# EAGLE design untitled (EAGLE 9.5.1)
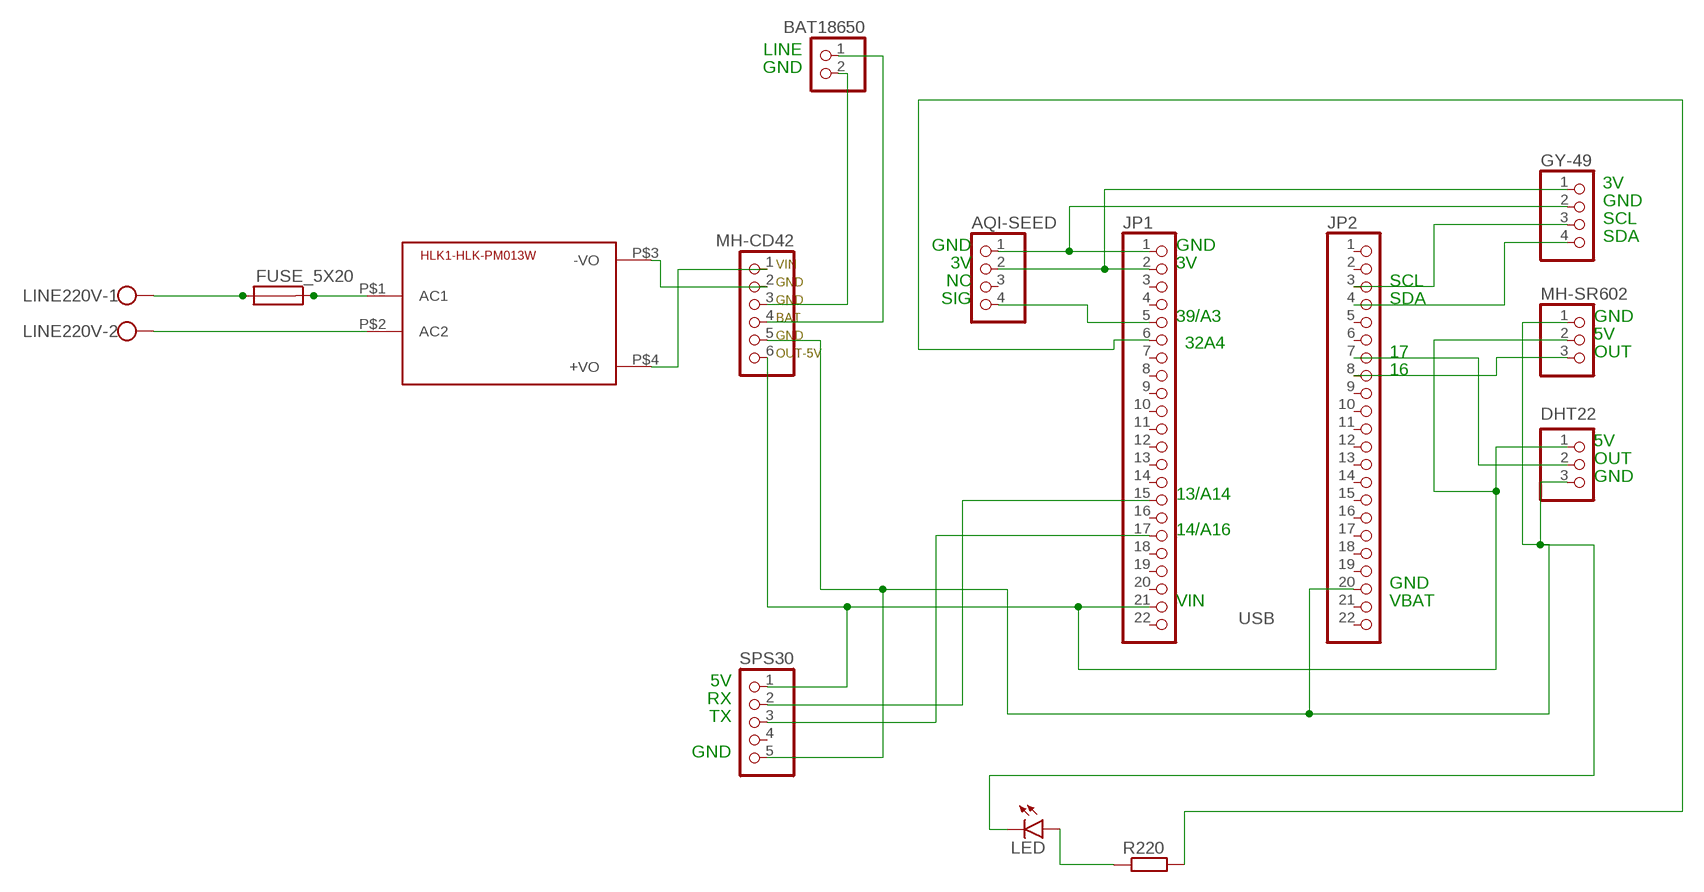
[diagram p0: schematic, sheet 1]

## Parts
AQI-SEED  PINHD-1X4  [1X04]
BAT18650  PINHD-1X2  [1X02]
FUSE_5X20  FH_5X20  [FH_5X20]
GY-49  PINHD-1X4  [1X04]
HLK1-HLK-PM013W  HLK-PM013W  [HLK-PM01]
JP1  PINHD-1X22  [1X22]
JP2  PINHD-1X22  [1X22]
JP6  DHT22  PINHD-1X3  [1X03]
LED  LED3MM  [LED3MM]
LINE220V  W237-102  [W237-102]
MH-CD42  PINHD-1X6  [1X06]
MH-SR602  PINHD-1X3  [1X03]
R220  R-EU_0204/5  [0204/5]
SPS30  PINHD-1X5  [1X05]

## Nets
N$1: FUSE_5X20.1A FUSE_5X20.1B LINE220V.1
N$2: FUSE_5X20.2A FUSE_5X20.2B HLK1-HLK-PM013W.P$1(AC1)
N$3: HLK1-HLK-PM013W.P$2(AC2) LINE220V.2
N$4: HLK1-HLK-PM013W.P$4(+VO) MH-CD42.1
N$5: HLK1-HLK-PM013W.P$3(-VO) MH-CD42.2
N$6: JP1.21 JP6.1 MH-CD42.6 MH-SR602.2 SPS30.1
N$7: JP2.20 JP6.3 LED.K(C) MH-CD42.5 MH-SR602.1 SPS30.5
N$8: JP2.7 JP6.2
N$9: JP2.8 MH-SR602.3
N$10: GY-49.4 JP2.4
N$11: GY-49.3 JP2.3
N$12: AQI-SEED.2 GY-49.1 JP1.2
N$13: AQI-SEED.1 GY-49.2 JP1.1
N$14: AQI-SEED.4 JP1.5
N$15: JP1.15 SPS30.2
N$16: LED.A R220.1
N$17: JP1.17 SPS30.3
N$18: BAT18650.2 MH-CD42.3
N$19: BAT18650.1 MH-CD42.4
N$20: JP1.6 R220.2
Unconnected: AQI-SEED.3 JP1.3 JP1.4 JP1.7 JP1.8 JP1.9 JP1.10 JP1.11 JP1.12 JP1.13 JP1.14 JP1.16 JP1.18 JP1.19 JP1.20 JP1.22 JP2.1 JP2.2 JP2.5 JP2.6 JP2.9 JP2.10 JP2.11 JP2.12 JP2.13 JP2.14 JP2.15 JP2.16 JP2.17 JP2.18 JP2.19 JP2.21 JP2.22 SPS30.4

## Notes on the sheet
- LINE
- GND
- 3V
- GND
- SCL
- SDA
- GND | GND
- VIN | 3V | 3V
- GND | NC | SCL
- GND | SIG | SDA
- BAT | 39/A3 | GND
- GND | 5V
- 32A4
- OUT-5V | 17 | OUT
- 16
- 5V
- OUT
- GND
- 13/A14
- 14/A16
- GND
- VIN | VBAT
- USB
- 5V
- RX
- TX
- GND

## Library data of the parts
AQI-SEED GY-49 = pinhead:PINHD-1X4: PIN HEADER
BAT18650 = pinhead:PINHD-1X2: PIN HEADER
FUSE_5X20 = keystone:FH_5X20: FUSE 5 x 20 mm
HLK1-HLK-PM013W = HLK-PM01:HLK-PM01: Hi-Link Power Supply HLK-PM01 3W Author: Ahmed Said <https://github.com/AhmedSaid/EAGLELibraries>
JP1 JP2 = pinhead:PINHD-1X22: PIN HEADER
JP6 MH-SR602 = pinhead:PINHD-1X3: PIN HEADER
LED = led:LED: LED OSRAM: - CHIPLED LG R971, LG N971, LY N971, LG Q971, LY Q971, LO R971, LY R971 LH N974, LH R974 LS Q976, LO Q976, LY Q976 LO Q996 - Hyper CHIPLED LW Q18S LB Q993, LB Q99A, LB R99A - SideLED LS A670, LO A670, LY A670, LG A670, LP A670 LB A673, LV A673, LT A673, LW A673 LH A674 LY A675 LS A676, LA A676, LO A676, LY A676, LW A676 LS A679, LY A679, LG A679 - Hyper Micro SIDELED® LS Y876, LA Y876, LO Y876, LY Y876 LT Y87S - SmartLED LW L88C, LW L88S LB L89C, LB L89S, LG L890 LS L89K, LO L89K, LY L89K LS L896, LA L896, LO L896, LY L896 - TOPLED LS T670, LO T670, LY T670, LG T670, LP T670 LSG T670, LSP T670, LSY T670, LOP T670, LYG T670 LG T671, LOG T671, LSG T671 LB T673, LV T673, LT T673, LW T673 LH T674 LS T676, LA T676, LO T676, LY T676, LB T676, LH T676, LSB T676, LW T676 LB T67C, LV T67C, LT T67C, LS T67K, LO T67K, LY T67K, LW E67C LS E67B, LA E67B, LO E67B, LY E67B, LB E67C, LV E67C, LT E67C LW T67C LS T679, LY T679, LG T679 LS T770, LO T770, LY T770, LG T770, LP T770 LB T773, LV T773, LT T773, LW T773 LH T774 LS E675, LA E675, LY E675, LS T675 LS T776, LA T776, LO T776, LY T776, LB T776 LHGB T686 LT T68C, LB T68C - Hyper Mini TOPLED® LB M676 - Mini TOPLED Santana® LG M470 LS M47K, LO M47K, LY M47K Source: http://www.osram.convergy.de LUXEON: - LUMILED® LXK2-PW12-R00, LXK2-PW12-S00, LXK2-PW14-U00, LXK2-PW14-V00 LXK2-PM12-R00, LXK2-PM12-S00, LXK2-PM14-U00 LXK2-PE12-Q00, LXK2-PE12-R00, LXK2-PE12-S00, LXK2-PE14-T00, LXK2-PE14-U00 LXK2-PB12-K00, LXK2-PB12-L00, LXK2-PB12-M00, LXK2-PB14-N00, LXK2-PB14-P00, LXK2-PB14-Q00 LXK2-PR12-L00, LXK2-PR12-M00, LXK2-PR14-Q00, LXK2-PR14-R00 LXK2-PD12-Q00, LXK2-PD12-R00, LXK2-PD12-S00 LXK2-PH12-R00, LXK2-PH12-S00 LXK2-PL12-P00, LXK2-PL12-Q00, LXK2-PL12-R00 Source: www.luxeon.com KINGBRIGHT: KA-3528ASYC Source: www.kingbright.com
LINE220V = con-wago-500:W237-102: WAGO SCREW CLAMP; MPN: 237-102; OC_FARNELL: unknown; OC_NEWARK: 70K9898
MH-CD42 = pinhead:PINHD-1X6: PIN HEADER; SPICEPREFIX: X
R220 = rcl:R-EU_: RESISTOR, European symbol; SPICEPREFIX: R
SPS30 = pinhead:PINHD-1X5: PIN HEADER

## Board
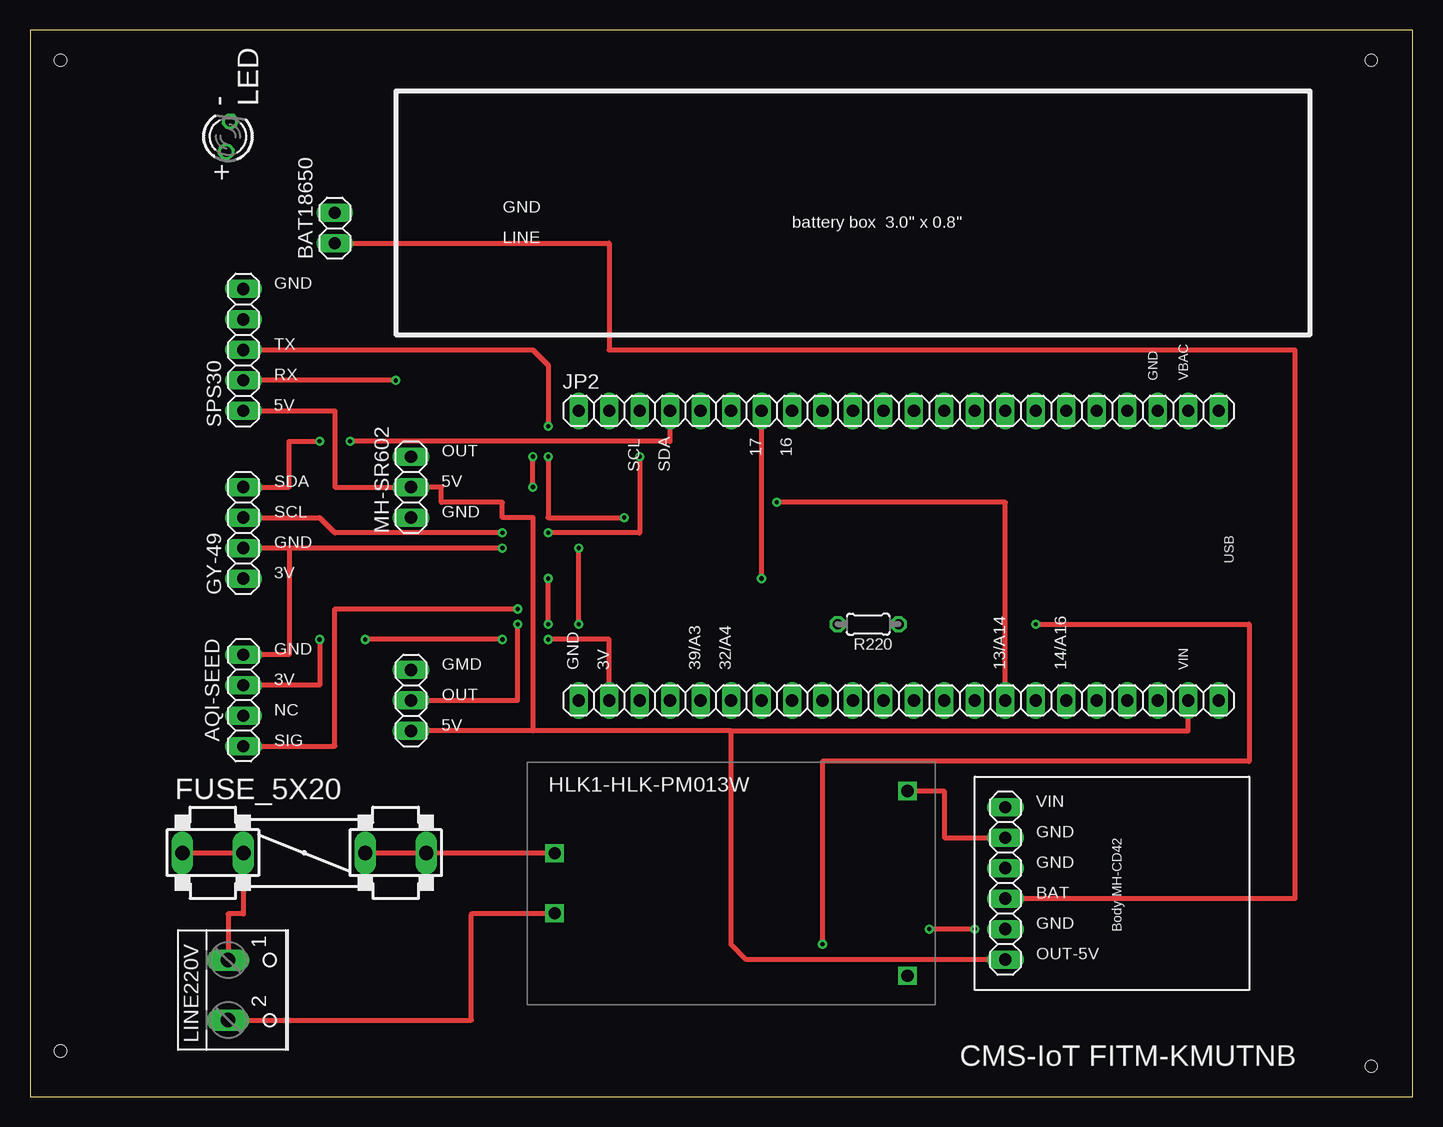
[diagram p1: board, top side]
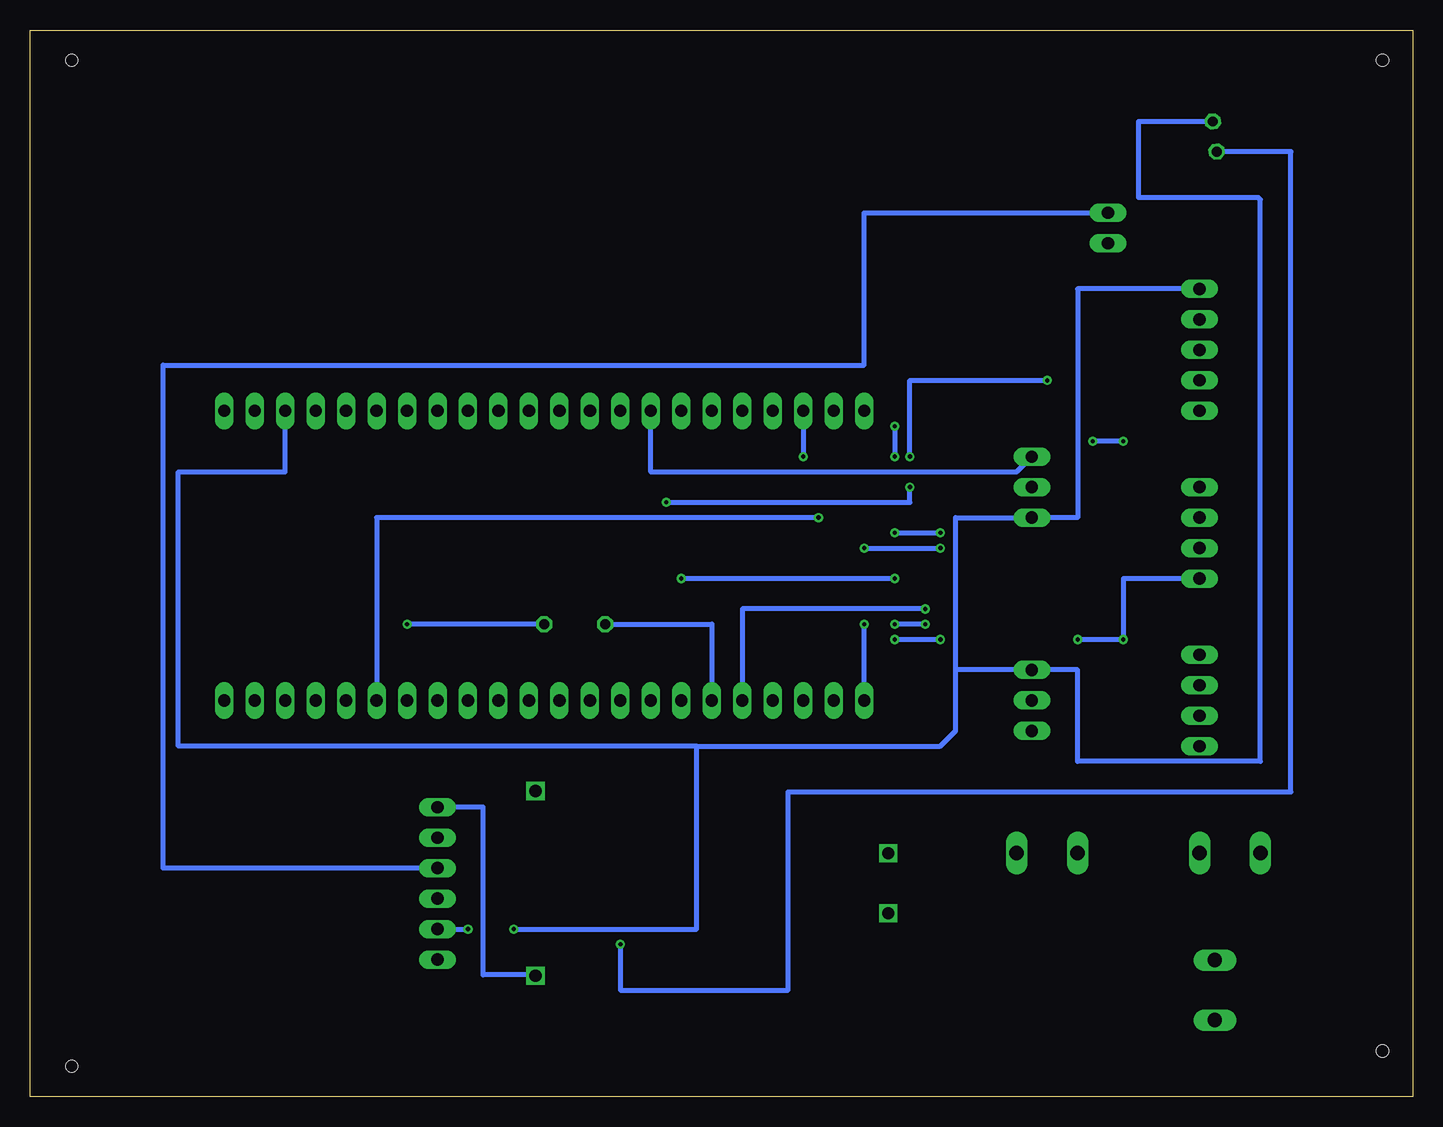
[diagram p2: board, bottom side, seen from below]

Size 115.24 x 88.89 mm. Coordinates in mm from the lower left corner, seen from the top.
Outline: 0,0 115.24,0 115.24,88.89 0,88.89 0,0
Copper layers (1*16): Top 0.035mm / dielectric 1.5mm / Bottom 0.035mm
Design rules "default": minimum track width 6mil, minimum drill 0.35mm, track to track 6mil, track to pad 6mil, pad to pad 6mil, via to via 6mil, smd to smd 6mil, copper to edge 40mil, drill to drill 6mil, minimum pad ring 10mil, minimum via ring 8mil, stop-mask expansion 4mil, vias tented up to drill 0mil, thermal gap 10mil
Holes 1 mm at 111.76,2.54 111.76,86.36 2.54,86.36 2.54,3.81

### Footprints (pad centres in the part's own frame; a part is rotated, then mirrored left to right if it is on the bottom)
1X04 = drill 1.016 long: 1 -3.81,0; 2 -1.27,0; 3 1.27,0; 4 3.81,0
1X02 = drill 1.016 long: 1 -1.27,0; 2 1.27,0
FH_5X20 = drill 1.194 long: 1A -10.16,0; 1B -5.08,0; 2A 10.16,0; 2B 5.08,0
HLK-PM01 = drill 1.016 square: P$1 -14.7,2.5; P$2 -14.7,-2.5; P$3 14.7,7.7; P$4 14.7,-7.7
1X22 = drill 1.016 long: 1 -26.67,0; 2 -24.13,0; 3 -21.59,0; 4 -19.05,0; 5 -16.51,0; 6 -13.97,0; 7 -11.43,0; 8 -8.89,0; 9 -6.35,0; 10 -3.81,0; 11 -1.27,0; 12 1.27,0; 13 3.81,0; 14 6.35,0; 15 8.89,0; 16 11.43,0; 17 13.97,0; 18 16.51,0; 19 19.05,0; 20 21.59,0; 21 24.13,0; 22 26.67,0
1X03 = drill 1.016 long: 1 -2.54,0; 2 0,0; 3 2.54,0
LED3MM = drill 0.813 octagon: A -1.27,0; K 1.27,0
W237-102 = drill 1.194 long: 1 -2.5,-1.27; 2 2.5,-1.27
1X06 = drill 1.016 long: 1 -6.35,0; 2 -3.81,0; 3 -1.27,0; 4 1.27,0; 5 3.81,0; 6 6.35,0
0204/5 = drill 0.813 octagon: 1 -2.54,0; 2 2.54,0
1X05 = drill 1.016 long: 1 -5.08,0; 2 -2.54,0; 3 0,0; 4 2.54,0; 5 5.08,0

### Placement (x,y rotation side)
AQI-SEED  17.78,33.02 270 top
BAT18650  25.4,72.39 90 top
FUSE_5X20  22.86,20.32 0 top
GY-49  17.78,46.99 90 top
HLK1-HLK-PM013W  58.42,17.78 0 top
JP1  72.39,33.02 0 top
JP2  72.39,57.15 0 top
JP6  31.75,33.02 90 top
LED  16.51,80.01 82.9 top
LINE220V  17.78,8.89 270 top
MH-CD42  81.28,17.78 270 top
MH-SR602  31.75,50.8 90 top
R220  69.85,39.37 180 top
SPS30  17.78,62.23 90 top

### Tracks (layer width: path | path; a pad name or v marks a point on that pad's centre or on a via)
N$1
  Top 0.406: LINE220V.1 16.51,15.24 17.78,15.24 FUSE_5X20.1B FUSE_5X20.1A
N$2
  Top 0.406: HLK1-HLK-PM013W.P$1 43.68,20.32 FUSE_5X20.2A FUSE_5X20.2B
N$3
  Top 0.406: LINE220V.2 36.79,6.39 36.79,15.2 36.83,15.24 36.87,15.28 HLK1-HLK-PM013W.P$2
N$4
  Bottom 0.406: HLK1-HLK-PM013W.P$4 73.2,10.16 77.47,10.16 77.47,24.13 MH-CD42.1
N$5
  Top 0.406: HLK1-HLK-PM013W.P$3 76.12,25.48 76.2,25.4 76.2,21.59 MH-CD42.2
N$6
  Top 0.406: MH-CD42.6 59.69,11.43 58.42,12.7 58.42,30.48 | 58.42,30.48 41.91,30.48 | 41.91,30.48 JP6.1 | 58.42,30.48 96.52,30.48 JP1.21 | 41.91,30.48 41.91,48.26 39.37,48.26 39.37,49.53 34.29,49.53 34.29,50.8 MH-SR602.2 25.4,50.8 25.4,57.15 SPS30.1
N$7  (via drill 0.35)
  Top 0.406: v78.74,13.97 v74.93,13.97
  Bottom 0.406: MH-CD42.5 v78.74,13.97 | v74.93,13.97 59.69,13.97 59.69,29.21 | 59.69,29.21 102.87,29.21 102.87,52.07 93.98,52.07 JP2.20 | 59.69,29.21 39.37,29.21 38.1,30.48 38.1,35.56 | 38.1,35.56 JP6.3 27.94,35.56 27.94,27.94 12.7,27.94 12.7,74.76 12.87,74.93 22.86,74.93 22.86,81.28 LED.K | 38.1,35.56 38.1,48.26 MH-SR602.1 27.94,48.26 27.94,67.31 SPS30.5
N$8  (via drill 0.35)
  Top 0.406: JP6.2 40.64,33.02 v40.64,39.37 | v43.18,39.37 v43.18,43.18 | v60.96,43.18 JP2.7
  Bottom 0.406: v40.64,39.37 v43.18,39.37 | v43.18,43.18 v60.96,43.18
N$9
  Bottom 0.406: MH-SR602.3 33.02,52.07 63.5,52.07 JP2.8
N$10  (via drill 0.35)
  Top 0.406: GY-49.4 21.59,50.8 21.59,54.61 v24.13,54.61 | JP2.4 53.34,54.61 v26.67,54.61
  Bottom 0.406: v24.13,54.61 v26.67,54.61
N$11  (via drill 0.35)
  Top 0.406: GY-49.3 24.13,48.26 25.4,46.99 v39.37,46.99 | v50.8,53.34 50.8,46.99 v43.18,46.99
  Bottom 0.406: JP2.3 v50.8,53.34 | v43.18,46.99 v39.37,46.99
N$12  (via drill 0.35)
  Top 0.406: JP1.2 48.26,38.1 v43.18,38.1 | v39.37,38.1 v27.94,38.1 | v24.13,38.1 24.13,34.29 AQI-SEED.2
  Bottom 0.406: v43.18,38.1 v39.37,38.1 | v27.94,38.1 v24.13,38.1 24.13,43.18 GY-49.1
N$13  (via drill 0.35)
  Top 0.406: v45.72,39.37 v45.72,45.72 | v39.37,45.72 21.59,45.72 | 21.59,45.72 GY-49.2 | 21.59,45.72 21.59,36.83 AQI-SEED.1
  Bottom 0.406: JP1.1 v45.72,39.37 | v45.72,45.72 v39.37,45.72
N$14  (via drill 0.35)
  Top 0.406: AQI-SEED.4 25.4,29.21 25.4,40.64 v40.64,40.64
  Bottom 0.406: v40.64,40.64 55.88,40.64 JP1.5
N$15  (via drill 0.35)
  Top 0.406: JP1.15 81.28,49.53 v62.23,49.53 | v41.91,50.8 v41.91,53.34 | v30.48,59.69 SPS30.2
  Bottom 0.406: v62.23,49.53 41.91,49.53 v41.91,50.8 | v30.48,59.69 41.91,59.69 v41.91,53.34
N$16  (via drill 0.35)
  Top 0.406: v83.82,39.37 101.6,39.37 101.6,27.94 66.04,27.94 v66.04,12.7
  Bottom 0.406: R220.1 v83.82,39.37 | v66.04,12.7 66.04,8.89 52.07,8.89 52.07,25.4 10.16,25.4 10.16,78.74 10.17,78.75 LED.A
N$17  (via drill 0.35)
  Top 0.406: SPS30.3 41.91,62.23 43.18,60.96 v43.18,55.88 | v43.18,53.34 43.18,48.26 v49.53,48.26
  Bottom 0.406: v49.53,48.26 86.36,48.26 JP1.17 | v43.18,55.88 v43.18,53.34
N$18
  Bottom 0.406: BAT18650.2 45.72,73.66 45.72,60.96 104.14,60.96 104.14,19.05 MH-CD42.3
N$19
  Top 0.406: BAT18650.1 48.26,71.12 48.26,62.23 105.41,62.23 105.41,16.51 MH-CD42.4
N$20
  Bottom 0.406: R220.2 58.42,39.37 JP1.6

### Text on the board
tNames: - | LED | + | GND | battery box 3.0" x 0.8" | LINE | GND | TX | RX | GND | VBAC | 5V | OUT | 17 | 16 | SCL | SDA | SDA | 5V | SCL | GND | GND | USB | 3V | GND | GMD | GND | 3V | 39/A3 | 32/A4 | 13/A14 | 14/A16 | VIN | 3V | OUT | NC | 5V | SIG | VIN | GND | Body MH-CD42 | GND | BAT | GND | OUT-5V | CMS-IoT FITM-KMUTNB